# EasyEDA Pro project ProProject_STM32F407IGT6_2024-02-27.epro, board PCB2_1
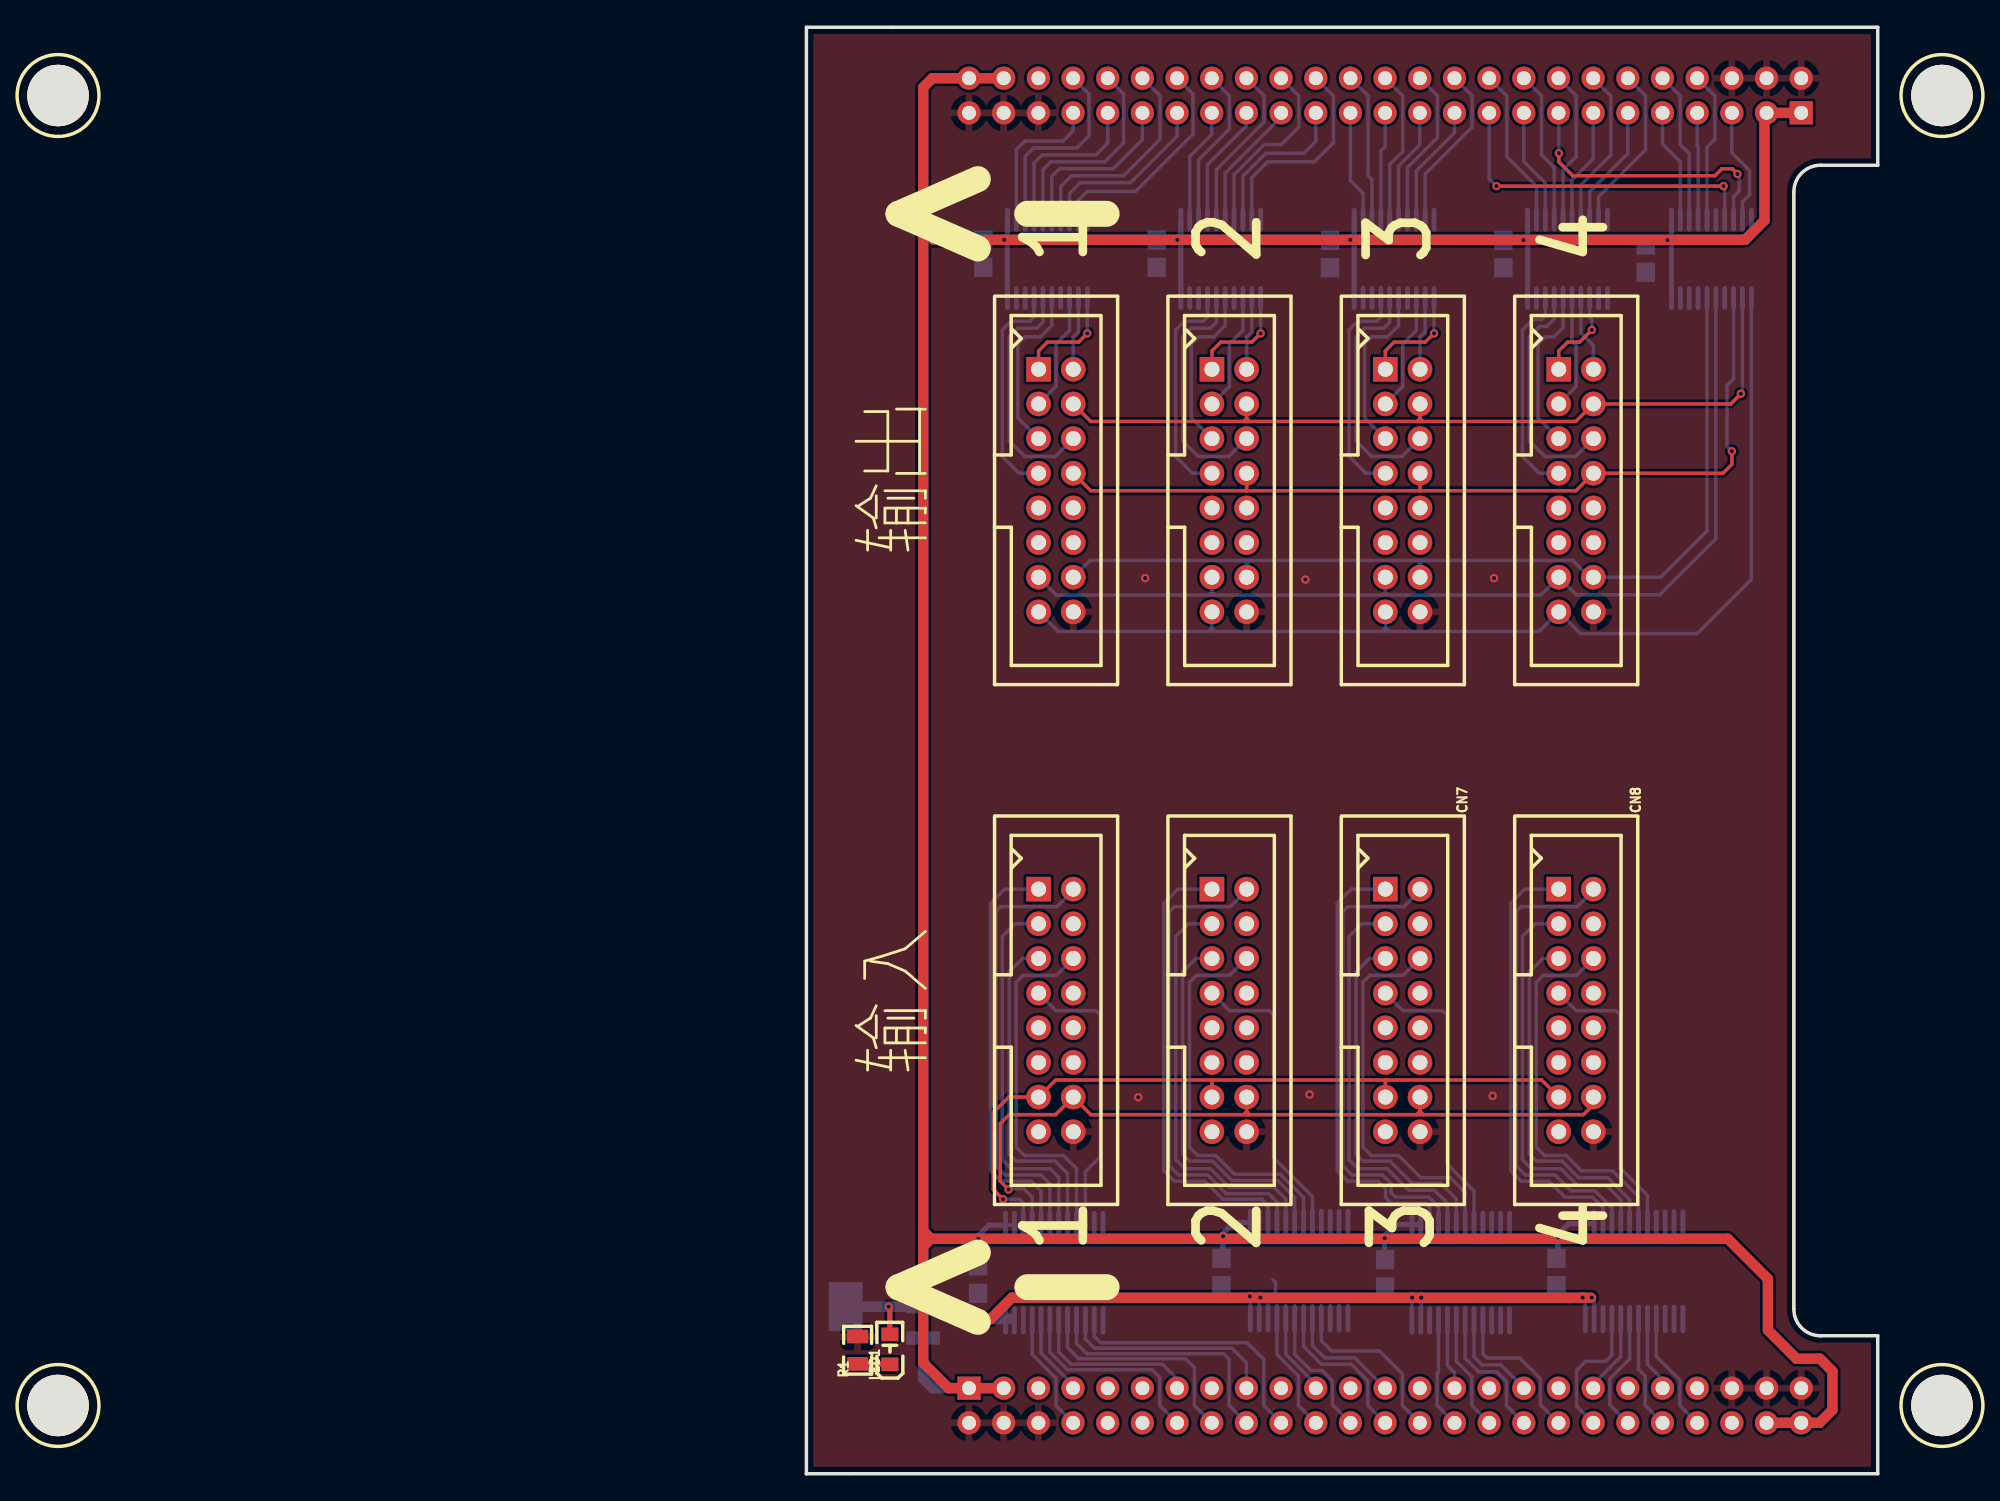
[diagram p4: board, top side]
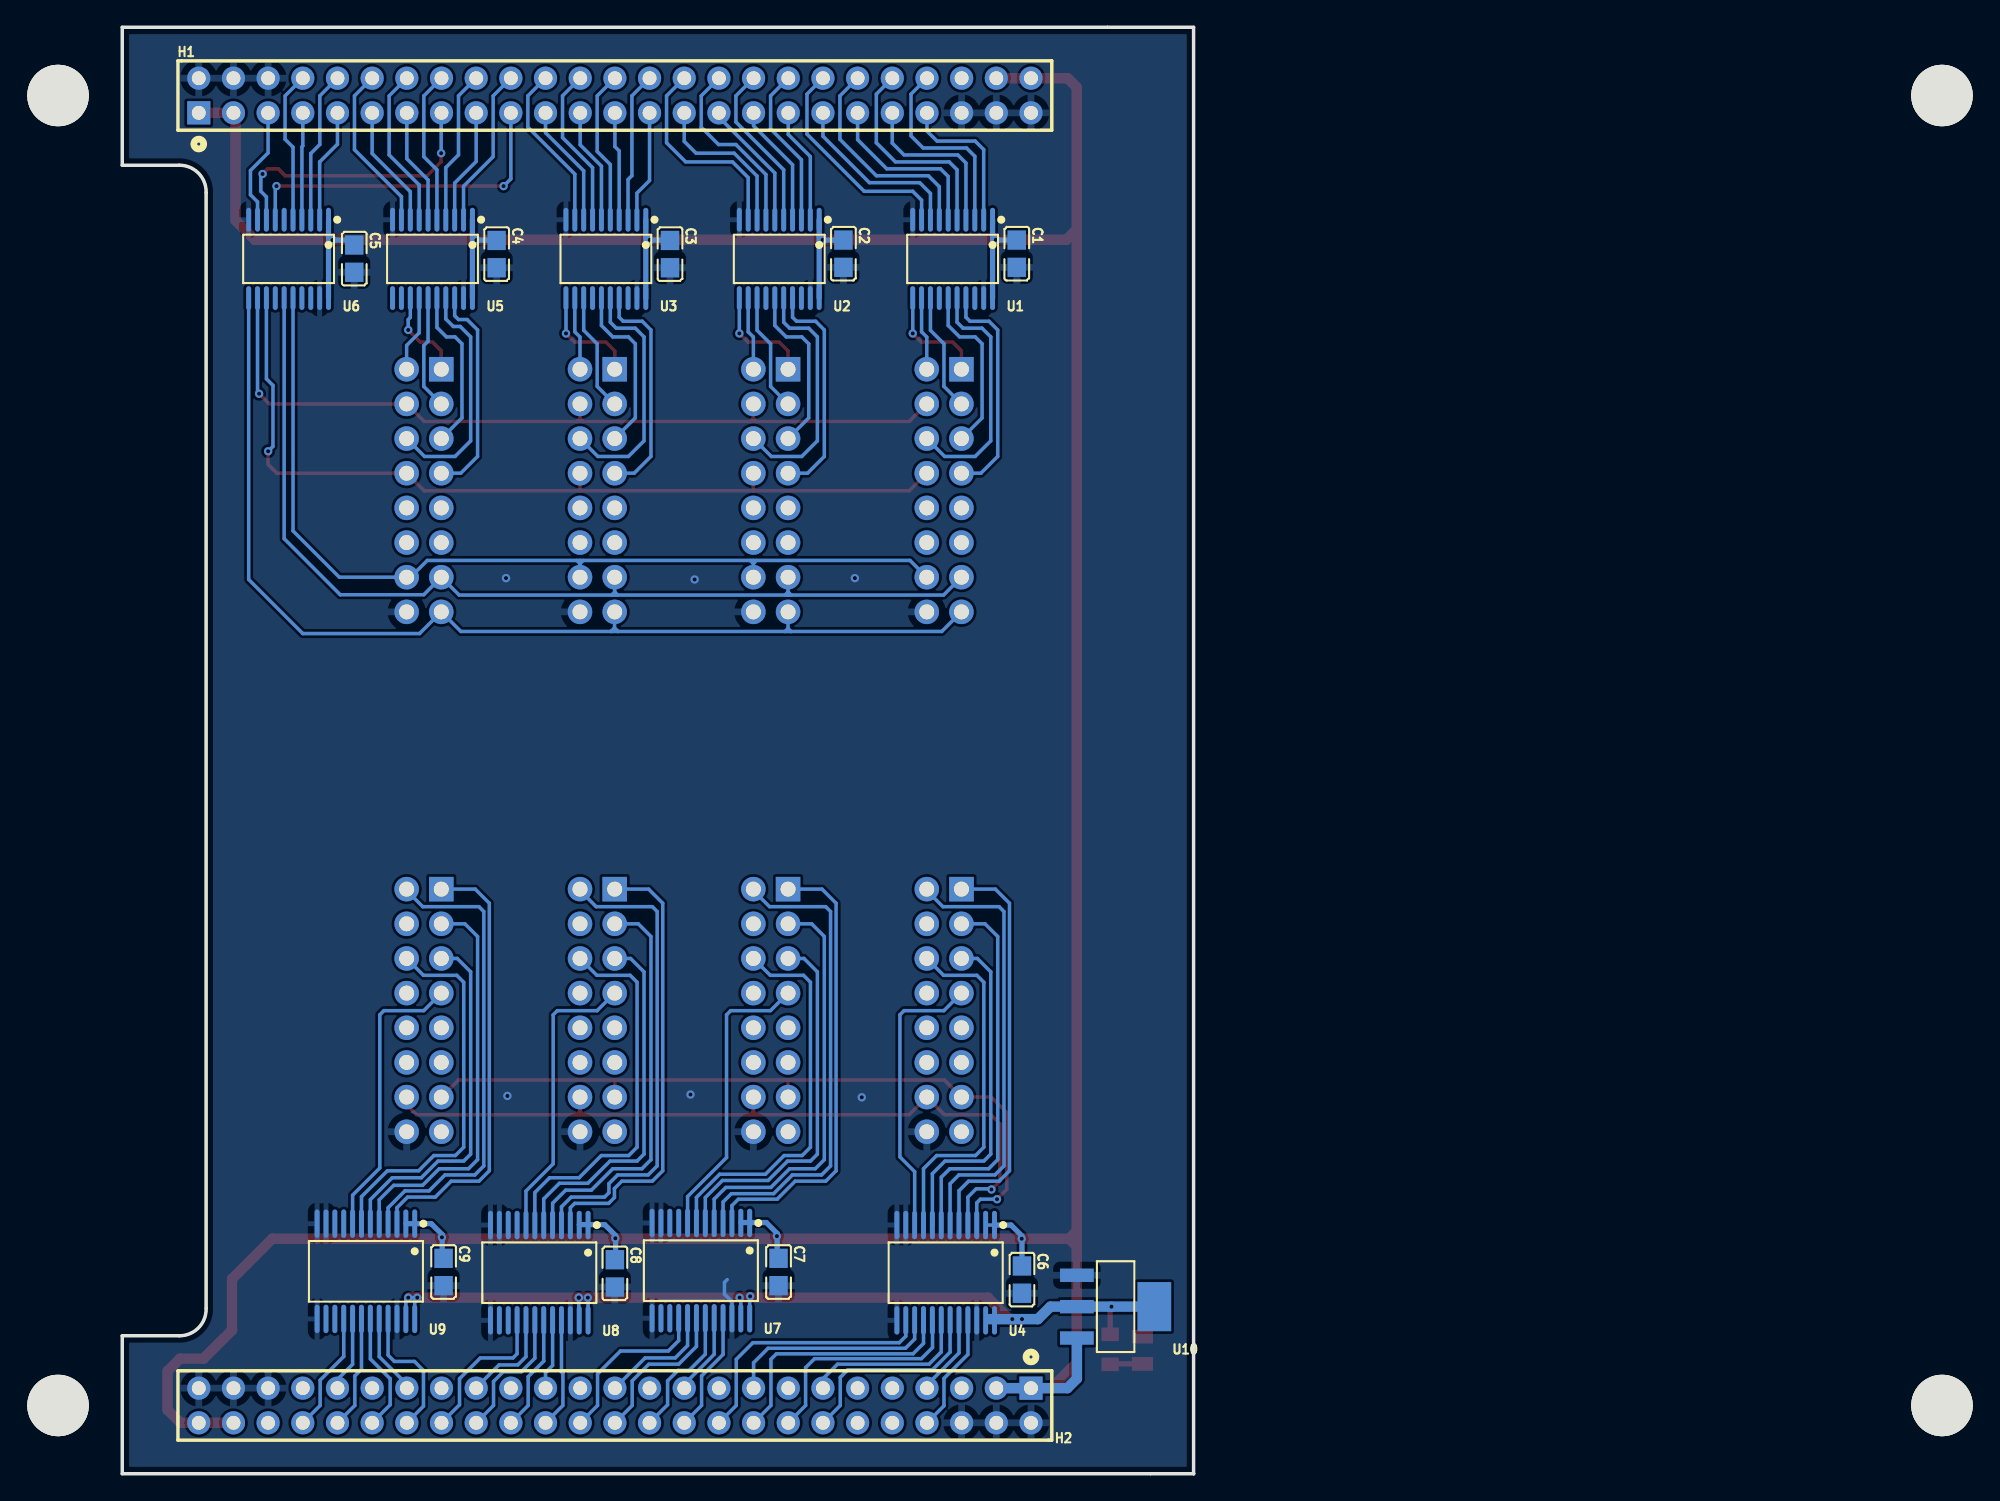
[diagram p5: board, bottom side, seen from below]

Outline 78.48 x 106 mm; copper layers: Top Layer, Bottom Layer. Coordinates in mm from the lower left corner of the outline.
Outline path: 0,0 78.48,0 78.48,10.11 74.29,10.11 arc(72.89,10.7) 72.33,12.11 72.33,93.89 arc(72.89,95.3) 74.29,95.89 78.48,95.89 78.48,106 0,106 0,0 0,0
Stack: Top Layer 0.035mm / Dielectric1 1.51mm FR4 er 4.5 / Bottom Layer 0.035mm

## Design rules (mm)
template: JLCPCB Capability(Two Layers Board)
spacing copperThickness1oz (default): track to track 0.102, other pairs 0.152 to 0.3
spacing copperThickness2oz: track to track 0.203, other pairs 0.152 to 0.3
track width copperThickness1oz (default): min 0.127, default 0.254, max 2.54
track width copperThickness2oz: min 0.203, default 0.254, max 2.54
differential pair differentialPair (default): width min 0.127, default 0.254, max 2.54; gap min 0.152, default 0.152
via viaSize (default): diameter min 0.5, default 0.61, max 10; hole min 0.3, default 0.305, max 6.3

## Placement (name value [footprint] x y rotation side)
C1  100nF  [C0805]  12.95 89.41 270 bottom
C2  100nF  [C0805]  25.65 89.41 270 bottom
C3  100nF  [C0805]  38.35 89.38 270 bottom
C4  100nF  [C0805]  51.05 89.38 270 bottom
C5  100nF  [C0805]  61.48 89.05 270 bottom
C6  100nF  [C0805]  12.57 14.22 270 bottom
C7  100nF  [C0805]  30.4 14.78 270 bottom
C8  100nF  [C0805]  42.39 14.68 270 bottom
C9  100nF  [C0805]  54.94 14.78 270 bottom
CN1  BH254V-16P  [IDC-TH_16P-P2.54-V-R2-C8-S2.54]  56.38 72.05 270 top
CN2  BH254V-16P  [IDC-TH_16P-P2.54-V-R2-C8-S2.54]  43.68 72.05 270 top
CN3  BH254V-16P  [IDC-TH_16P-P2.54-V-R2-C8-S2.54]  30.98 72.05 270 top
CN4  BH254V-16P  [IDC-TH_16P-P2.54-V-R2-C8-S2.54]  18.28 72.05 270 top
CN5  BH254V-16P  [IDC-TH_16P-P2.54-V-R2-C8-S2.54]  18.28 33.95 270 top
CN6  BH254V-16P  [IDC-TH_16P-P2.54-V-R2-C8-S2.54]  30.98 33.95 270 top
CN7  BH254V-16P  [IDC-TH_16P-P2.54-V-R2-C8-S2.54]  43.68 33.95 270 top
CN8  BH254V-16P  [IDC-TH_16P-P2.54-V-R2-C8-S2.54]  56.38 33.95 270 top
H1  FH-00077  [HDR-TH_50P-P2.54-V-F-R2-C25-S2.54-1]  42.39 101 180 bottom
H2  FH-00077  [HDR-TH_50P-P2.54-V-F-R2-C25-S2.54-1]  42.39 5 0 bottom
LED1  -  [LED0805-RD_RED]  6.12 9.11 90 top
NOREF  -  [Pad_ie198]  83.18 5 180 top
NOREF#2  -  [Pad_ie201]  -54.82 5 180 top
NOREF#3  -  [Pad_ie205]  -54.82 101 180 top
NOREF#4  -  [Pad_ie168]  83.18 101 180 top
R1  1K  [R0805]  3.75 9.05 90 top
U1  SN74HC245PW  [TSSOP-20_L6.5-W4.4-P0.65-LS6.4-BL]  17.65 89.03 0 bottom
U2  SN74HC245PW  [TSSOP-20_L6.5-W4.4-P0.65-LS6.4-BL]  30.35 89.03 0 bottom
U3  SN74HC245PW  [TSSOP-20_L6.5-W4.4-P0.65-LS6.4-BL]  43.05 89.03 0 bottom
U4  SN74LVC4245ADBR  [SSOP-24_L8.4-W5.8-P0.65-LS7.8-BL]  18.16 14.73 0 bottom
U5  SN74HC245PW  [TSSOP-20_L6.5-W4.4-P0.65-LS6.4-BL]  55.75 89.03 0 bottom
U6  SN74HC245PW  [TSSOP-20_L6.5-W4.4-P0.65-LS6.4-BL]  66.29 89.03 0 bottom
U7  SN74LVC4245ADBR  [SSOP-24_L8.4-W5.8-P0.65-LS7.8-BL]  36.09 14.88 0 bottom
U8  SN74LVC4245ADBR  [SSOP-24_L8.4-W5.8-P0.65-LS7.8-BL]  47.93 14.73 0 bottom
U9  SN74LVC4245ADBR  [SSOP-24_L8.4-W5.8-P0.65-LS7.8-BL]  60.63 14.83 0 bottom
U10  AMS1117-3.3  [SOT-223-4_L6.5-W3.5-P2.30-LS7.0-BR]  5.72 12.24 0 bottom

## Footprints (pads in the part's own frame, mm; a bottom-side part is the same pattern mirrored in y, then rotated)
C0805
  rect 1.41x1.35 smd: 1(-1,0) 2(1,0)
HDR-TH_50P-P2.54-V-F-R2-C25-S2.54-1
  rect 1.7x1.7 hole 1.02: 1(-30.48,-1.27)
  round 1.7 hole 1.02: 2(-30.48,1.27) 3(-27.94,-1.27) 4(-27.94,1.27) 5(-25.4,-1.27) 6(-25.4,1.27) 7(-22.86,-1.27) 8(-22.86,1.27) 9(-20.32,-1.27) 10(-20.32,1.27) 11(-17.78,-1.27) 12(-17.78,1.27) 13(-15.24,-1.27) 14(-15.24,1.27) 15(-12.7,-1.27) 16(-12.7,1.27) 17(-10.16,-1.27) 18(-10.16,1.27) 19(-7.62,-1.27) 20(-7.62,1.27) 21(-5.08,-1.27) 22(-5.08,1.27) 23(-2.54,-1.27) 24(-2.54,1.27) 25(0,-1.27) 26(0,1.27) 27(2.54,-1.27) 28(2.54,1.27) 29(5.08,-1.27) 30(5.08,1.27) 31(7.62,-1.27) 32(7.62,1.27) 33(10.16,-1.27) 34(10.16,1.27) 35(12.7,-1.27) 36(12.7,1.27) 37(15.24,-1.27) 38(15.24,1.27) 39(17.78,-1.27) 40(17.78,1.27) 41(20.32,-1.27) 42(20.32,1.27) 43(22.86,-1.27) 44(22.86,1.27) 45(25.4,-1.27) 46(25.4,1.27) 47(27.94,-1.27) 48(27.94,1.27) 49(30.48,-1.27) 50(30.48,1.27)
IDC-TH_16P-P2.54-V-R2-C8-S2.54
  rect 1.8x1.8 hole 1.1: 1(-8.89,-1.27)
  round 1.8 hole 1.1: 2(-8.89,1.27) 3(-6.35,-1.27) 4(-6.35,1.27) 5(-3.81,-1.27) 6(-3.81,1.27) 7(-1.27,-1.27) 8(-1.27,1.27) 9(1.27,-1.27) 10(1.27,1.27) 11(3.81,-1.27) 12(3.81,1.27) 13(6.35,-1.27) 14(6.35,1.27) 15(8.89,-1.27) 16(8.89,1.27)
LED0805-RD_RED
  rect 1x1.25 smd: 1(-1.1,0) 2(1.1,0)
Pad_ie168
  round 4.5 hole 4.5: 4(0,0)
Pad_ie198
  round 4.5 hole 4.5: 4(0,0)
Pad_ie201
  round 4.5 hole 4.5: 4(0,0)
Pad_ie205
  round 4.5 hole 4.5: 4(0,0)
R0805
  rect 1x1.55 smd: 1(-1,0) 2(1,0)
SOT-223-4_L6.5-W3.5-P2.30-LS7.0-BR
  rect 2.47x0.98 smd: 1(2.835,-2.3) 2(2.835,0) 3(2.835,2.3)
  rect 2.47x3.6 smd: 4(-2.835,0)
SSOP-24_L8.4-W5.8-P0.65-LS7.8-BL
  oval 0.364x2.082 smd: 1(-3.575,-3.491) 2(-2.925,-3.491) 3(-2.275,-3.491) 4(-1.625,-3.491) 5(-0.975,-3.491) 6(-0.325,-3.491) 7(0.325,-3.491) 8(0.975,-3.491) 9(1.625,-3.491) 10(2.275,-3.491) 11(2.925,-3.491) 12(3.575,-3.491) 13(3.575,3.491) 14(2.925,3.491) 15(2.275,3.491) 16(1.625,3.491) 17(0.975,3.491) 18(0.325,3.491) 19(-0.325,3.491) 20(-0.975,3.491) 21(-1.625,3.491) 22(-2.275,3.491) 23(-2.925,3.491) 24(-3.575,3.491)
TSSOP-20_L6.5-W4.4-P0.65-LS6.4-BL
  oval 0.364x1.742 smd: 1(-2.925,-2.871) 2(-2.275,-2.871) 3(-1.625,-2.871) 4(-0.975,-2.871) 5(-0.325,-2.871) 6(0.325,-2.871) 7(0.975,-2.871) 8(1.625,-2.871) 9(2.275,-2.871) 10(2.925,-2.871) 11(2.925,2.871) 12(2.275,2.871) 13(1.625,2.871) 14(0.975,2.871) 15(0.325,2.871) 16(-0.325,2.871) 17(-0.975,2.871) 18(-1.625,2.871) 19(-2.275,2.871) 20(-2.925,2.871)

## Nets
+3.3V: LED1.2 U4.23 U4.24 U7.23 U7.24 U8.23 U8.24 U9.23 U9.24 U10.2 U10.4
+5V: C1.1 C2.1 C3.1 C4.1 C5.1 C6.1 C7.1 C8.1 C9.1 H1.1 H1.3 H1.48 H1.50 H2.1 H2.3 H2.48 H2.50 U1.1 U1.20 U2.1 U2.20 U3.1 U3.20 U4.1 U4.2 U5.1 U5.20 U6.1 U6.20 U7.1 U7.2 U8.1 U8.2 U9.1 U9.2 U10.3
GND: C1.2 C2.2 C3.2 C4.2 C5.2 C6.2 C7.2 C8.2 C9.2 CN1.16 CN2.16 CN3.16 CN4.16 CN5.16 CN6.16 CN7.16 CN8.16 H1.2 H1.4 H1.6 H1.45 H1.47 H1.49 H2.2 H2.4 H2.6 H2.45 H2.47 H2.49 R1.2 U1.10 U1.19 U2.10 U2.19 U3.10 U3.19 U4.11 U4.12 U4.13 U4.22 U5.10 U5.19 U6.10 U6.19 U7.11 U7.12 U7.13 U7.22 U8.11 U8.12 U8.13 U8.22 U9.11 U9.12 U9.13 U9.22 U10.1
BD0: H1.16 U5.5
BD1: H1.20 U5.2
BD2: H1.24 U3.7
BD3: H1.28 U3.3
BD4: H1.32 U2.7
BD5: H1.36 U2.3
BD6: H1.40 U1.7
BD7: H1.44 U1.3
BD8: H2.16 U4.17
BD9: H2.20 U4.14
BD10: H2.24 U7.19
BD11: H2.28 U7.16
BD12: H2.32 U8.19
BD13: H2.36 U8.16
BD14: H2.40 U9.19
BD15: H2.44 U9.16
CKA: H1.8 U6.5
CKA_IN: H2.8 U4.21
CLK: CN1.13 CN2.13 CN3.13 CN4.13 CN5.13 CN6.13 CN7.13 CN8.13 U4.3 U6.15
CN1_NC2: H1.23 U3.6
CN1_NC2_O: U3.14
CN1_NC3: H1.27 U3.2
CN1_NC3_O: U3.18
CN1_NC4: H1.31 U2.6
CN1_NC4_O: U2.14
CN1_NC5: H1.35 U2.2
CN1_NC5_O: U2.18
CN1_NC6: H1.39 U1.6
CN1_NC6_O: U1.14
CN1_NC7: H1.43 U1.2
CN1_NC7_O: U1.18
CN1_NC8: H1.46
CN2_NC0: H2.15
CN2_NC1: H2.19
CN2_NC2: H2.23
CN2_NC3: H2.27
CN2_NC4: H2.31
CN2_NC5: H2.35
CN2_NC6: H2.39
CN2_NC7: H2.43
CN2_NC8: H2.46
GD0: H1.13 U5.6
GD1: H1.17 U5.3
GD2: H1.21 U3.8
GD3: H1.25 U3.4
GD4: H1.29 U2.8
GD5: H1.33 U2.4
GD6: H1.37 U1.8
GD7: H1.41 U1.4
GD8: H2.13 U4.18
GD9: H2.17 U4.15
GD10: H2.21 U7.20
GD11: H2.25 U7.17
GD12: H2.29 U8.20
GD13: H2.33 U8.17
GD14: H2.37 U9.20
GD15: H2.41 U9.17
HUB1_B1: CN1.3 U5.15
HUB1_B2: CN1.7 U5.18
HUB1_G1: CN1.2 U5.14
HUB1_G2: CN1.6 U5.17
HUB1_R1: CN1.1 U5.13
HUB1_R2: CN1.5 U5.16
HUB2_B1: CN2.3 U3.13
HUB2_B2: CN2.7 U3.17
HUB2_G1: CN2.2 U3.12
HUB2_G2: CN2.6 U3.16
HUB2_R1: CN2.1 U3.11
HUB2_R2: CN2.5 U3.15
HUB3_B1: CN3.3 U2.13
HUB3_B2: CN3.7 U2.17
HUB3_G1: CN3.2 U2.12
HUB3_G2: CN3.6 U2.16
HUB3_R1: CN3.1 U2.11
HUB3_R2: CN3.5 U2.15
HUB4_B1: CN4.3 U1.13
HUB4_B2: CN4.7 U1.17
HUB4_G1: CN4.2 U1.12
HUB4_G2: CN4.6 U1.16
HUB4_R1: CN4.1 U1.11
HUB4_R2: CN4.5 U1.15
HUB5_B1: CN5.3 U4.7
HUB5_B2: CN5.7 U4.10
HUB5_G1: CN5.2 U4.6
HUB5_G2: CN5.6 U4.9
HUB5_R1: CN5.1 U4.5
HUB5_R2: CN5.5 U4.8
HUB6_B1: CN6.3 U7.5
HUB6_B2: CN6.7 U7.8
HUB6_G1: CN6.2 U7.4
HUB6_G2: CN6.6 U7.7
HUB6_R1: CN6.1 U7.3
HUB6_R2: CN6.5 U7.6
HUB7_B1: CN7.3 U8.5
HUB7_B2: CN7.7 U8.8
HUB7_G1: CN7.2 U8.4
HUB7_G2: CN7.6 U8.7
HUB7_R1: CN7.1 U8.3
HUB7_R2: CN7.5 U8.6
HUB8_B1: CN8.3 U9.5
HUB8_B2: CN8.7 U9.8
HUB8_G1: CN8.2 U9.4
HUB8_G2: CN8.6 U9.7
HUB8_R1: CN8.1 U9.3
HUB8_R2: CN8.5 U9.6
LAT: CN1.14 CN2.14 CN3.14 CN4.14 CN5.14 CN6.14 CN7.14 CN8.14 U4.4 U6.16
OE_PWM_B: H1.19 U6.7
OE_PWM_B_O: CN1.8 CN2.8 CN3.8 CN4.8 U6.13
OE_PWM_G: H1.15 U6.8
OE_PWM_G_O: CN1.4 CN2.4 CN3.4 CN4.4 U6.12
OE_PWM_R: H1.5 U6.9
OE_PWM_R_O: CN1.15 CN2.15 CN3.15 CN4.15 U6.11
RD0: H1.14 U5.7
RD1: H1.18 U5.4
RD2: H1.22 U3.9
RD3: H1.26 U3.5
RD4: H1.30 U2.9
RD5: H1.34 U2.5
RD6: H1.38 U1.9
RD7: H1.42 U1.5
RD8: H2.14 U4.19
RD9: H2.18 U4.16
RD10: H2.22 U7.21
RD11: H2.26 U7.18
RD12: H2.30 U8.21
RD13: H2.34 U8.18
RD14: H2.38 U9.21
RD15: H2.42 U9.18
STB: H1.7 U6.4
STB_IN: H2.7 U4.20
$1N2786: H2.5
$1N5133: U6.6
$1N5154: U6.14
$1N5922: CN5.15
$1N5952: CN6.15
$1N5982: CN7.15
$1N6012: CN8.15
$1N6595: U7.9
$1N6597: U7.10
$1N6609: U7.15
$1N6611: U7.14
$1N6833: U8.9
$1N6835: U8.10
$1N6847: U8.15
$1N6849: U8.14
$1N7071: U9.9
$1N7073: U9.10
$1N7180: U9.15
$1N7181: U9.14
$1N9953: LED1.1 R1.1

Pads without a net: CN1 9 10 11 12; CN2 9 10 11 12; CN3 9 10 11 12; CN4 9 10 11 12; CN5 4 8 9 10 11 12; CN6 4 8 9 10 11 12; CN7 4 8 9 10 11 12; CN8 4 8 9 10 11 12; H1 9 10 11 12; H2 9 10 11 12; NOREF 4; NOREF#2 4; NOREF#3 4; NOREF#4 4; U5 8 9 11 12; U6 2 3 17 18

## Via types
v1: diameter 0.61, hole 0.305, Top Layer to Bottom Layer, 37 vias

## Routing (per net, layer and track width the routed paths; a pad name or vN(x,y) marks a point on that pad's centre or on a via; arc(x,y) is an arc through that point)
+3.3V: length 70.7
  Top Layer w0.254: v1(32.49,13) 32.48,13 32.48,12.9 ; v1(13.28,11.33) 13.28,11.38
  Top Layer w0.381: LED1.2 6.12,12.15 v1(6.02,12.24)
  Top Layer w0.762: v1(12.57,11.33) v1(13.28,11.33) 13.49,11.33 15.06,12.9 v1(33.26,12.9) v1(44.37,12.9) v1(45.04,12.9) v1(56.87,12.9) 57.48,12.9
  Bottom Layer w0.254: U7.24 32.52,12.97 v1(32.49,13) ; v1(33.26,12.9) 33.17,12.82 U7.23 ; U8.24 44.36,12.88 v1(44.37,12.9) ; v1(45.04,12.9) 45.04,11.27 U8.23 ; U9.23 57.7,12.73 v1(57.53,12.9) v1(56.87,12.9) 57.06,12.72 U9.24
  Bottom Layer w0.762: U10.4 v1(6.02,12.24) 10.49,12.24 11.4,11.33 v1(12.57,11.33) v1(13.28,11.33) 14.96,11.33
+5V: length 329.6
  Top Layer w0.762: H2.3 H2.1 10.42,6.27 8.56,8.13 8.56,16.66 ; 9.13,17.22 8.56,17.79 ; 9.13,17.22 8.56,16.66 ; 9.13,17.22 v1(12.59,17.22) 67.49,17.22 70.43,14.28 70.43,10.52 72.52,8.43 74.24,8.43 75.16,7.52 75.16,4.67 74.22,3.73 H2.50 H2.48 ; 8.56,17.79 8.56,16.66 ; 8.56,17.79 8.56,91.19 ; 8.56,91.19 9.32,90.42 v1(14.49,90.42) v1(27.17,90.42) v1(39.84,90.42) 68.76,90.42 70.18,91.85 70.18,99.47 ; 8.56,91.19 8.56,101.6 9.23,102.27 H1.50 H1.48 ; H1.1 70.44,99.73 70.18,99.47 ; 70.18,99.47 70.18,99.58 H1.3
  Bottom Layer w0.254: 14.59,18.22 U4.2
  Bottom Layer w0.381: C1.1 14.44,90.41 14.73,90.7 ; 33.17,18.41 31.3,18.41 30.51,17.61 30.51,15.41 ; 52.83,90.7 v1(52.54,90.41) 51.05,90.41 ; 52.83,90.7 U5.1 ; 52.83,90.7 U5.20 ; 27.43,90.7 U2.1 ; 27.43,90.7 27.14,90.41 C2.1 ; 27.43,90.7 U2.20 ; 40.13,90.7 39.84,90.41 38.35,90.41 ; 40.13,90.7 U3.1 ; 40.13,90.7 U3.20 ; 63.37,90.7 v1(63.08,90.41) 61.6,90.41 ; 63.37,90.7 U6.1 ; 63.37,90.7 U6.20 ; 14.73,90.7 U1.20 ; 14.73,90.7 U1.1 ; 42.34,15.26 42.34,17.46 43.14,18.26 45.01,18.26 ; U9.2 U9.1 55.84,18.32 55.04,17.53 55.04,15.33 ; C6.1 12.57,17.42 13.37,18.22 14.59,18.22
  Bottom Layer w0.762: 8.55,9.94 8.55,6.97 9.25,6.27 H2.1 H2.3
  vias: v1(30.53,17.41) v1(42.36,17.25) v1(55.06,17.32)
GND: length 3.1
  Bottom Layer w0.254: 34.16,14.22 34.37,14.02 34.37,13.16 33.82,12.61 U7.22
  vias: v1(24.31,27.58) v1(24.82,65.63) v1(36.55,65.53) v1(36.86,27.79) v1(50.27,27.69) v1(50.37,65.63)
(no net): length 40.9
  Bottom Layer w0.254: H1.12 61.47,100.97 61.47,97.03 58.03,93.59 U5.9 ; U6.2 64.02,96.13 ; 64.02,96.13 62.71,97.43 H1.9 ; 64.02,96.13 64.02,96.14 ; H1.11 60.17,96.75 57.38,93.95 U5.8 ; U6.3 64.67,96.75 64.01,97.41 64.01,100.97 H1.10
BD0: length 11.3
  Bottom Layer w0.254: U5.5 55.43,95.56 56.39,96.52 56.39,100.97 H1.16
BD1: length 11.8
  Bottom Layer w0.254: U5.2 53.48,94.35 51.31,96.52 51.31,100.97 H1.20
BD2: length 11.8
  Bottom Layer w0.254: H1.24 46.23,100.97 46.23,97.92 44.03,95.72 U3.7
BD3: length 11
  Bottom Layer w0.254: H1.28 41.15,100.97 41.15,95.12 41.43,94.84 U3.3
BD4: length 13.6
  Bottom Layer w0.254: H1.32 36.07,100.97 36.07,98.68 34.8,97.41 33.53,97.41 31.33,95.21 U2.7
BD5: length 11.8
  Bottom Layer w0.254: U2.3 28.73,96.29 30.99,98.55 30.99,100.97 H1.36
BD6: length 16.2
  Bottom Layer w0.254: U1.7 18.63,94.32 19.43,95.12 23.24,95.12 25.91,97.79 25.91,100.97 H1.40
BD7: length 14.7
  Bottom Layer w0.254: H1.44 20.7,101.1 20.7,98.04 19.81,97.16 16.64,97.16 16.03,96.55 U1.3
BD8: length 16.5
  Bottom Layer w0.254: H2.16 28.42,5 28.42,7.77 27.76,8.43 19.94,8.43 19.13,9.25 19.13,11.23 U4.17
BD9: length 19.5
  Bottom Layer w0.254: H2.20 33.5,5 33.5,8.38 32.28,9.6 21.56,9.6 21.09,10.07 U4.14
BD10: length 9.8
  Bottom Layer w0.254: U7.19 35.77,8.76 36.96,7.57 37.77,7.57 38.53,6.81 38.53,5.05 H2.24
BD11: length 12.7
  Bottom Layer w0.254: U7.16 37.72,9.75 38.48,8.99 41.99,8.99 43.66,7.31 43.66,5 H2.28
BD12: length 8.5
  Bottom Layer w0.254: H2.32 48.74,5 48.74,7.11 47.61,8.25 U8.19
BD13: length 11.2
  Bottom Layer w0.254: H2.36 53.77,5.05 53.77,6.96 52.25,8.48 49.86,8.48 49.56,8.79 U8.16
BD14: length 8.8
  Bottom Layer w0.254: U9.19 60.31,8.41 58.85,6.96 58.85,5.05 H2.40
BD15: length 8.9
  Bottom Layer w0.254: U9.16 62.26,8.59 63.98,6.86 63.98,5 H2.44
CKA: length 11.1
  Bottom Layer w0.254: U6.5 65.97,97.21 66.55,97.79 66.55,100.97 H1.8
CKA_IN: length 8.8
  Bottom Layer w0.254: H2.8 18.29,4.97 18.29,6.99 16.54,8.74 U4.21
CLK: length 129.8
  Top Layer w0.254: v1(14.4,20.12) 13.69,20.83 13.69,26.47 14.82,27.6 CN5.13 18.26,28.85 29.65,28.85 ; CN6.13 29.71,28.8 29.65,28.85 ; CN8.13 53.85,28.85 42.43,28.85 ; 42.43,28.85 29.65,28.85 ; 42.43,28.85 42.41,28.83 CN7.13
  Bottom Layer w0.254: 29.71,64.39 29.93,64.39 ; 29.71,64.39 29.71,64.39 29.71,64.61 ; 29.71,64.39 29.48,64.39 ; 29.93,64.39 29.71,64.61 ; 29.93,64.39 42.18,64.39 ; 42.41,64.61 42.18,64.39 ; 42.41,64.61 CN2.13 ; 42.41,64.61 42.63,64.39 ; 42.41,64.61 42.41,64.39 42.41,64.39 ; 42.18,64.39 42.41,64.39 ; 29.71,64.61 29.48,64.39 ; 29.71,64.61 CN3.13 ; 29.48,64.39 18.32,64.39 CN4.13 ; 42.63,64.39 53.8,64.39 CN1.13 56.39,64.41 62.51,64.41 66.62,68.52 U6.15 ; 42.63,64.39 42.41,64.39 ; 15.89,18.22 15.89,19.85 15.62,20.12 v1(14.4,20.12)
CN1_NC2: length 8.5
  Bottom Layer w0.254: H1.23 44.93,97.38 43.38,95.83 U3.6
CN1_NC3: length 8.2
  Bottom Layer w0.254: U3.2 40.78,93.84 39.85,94.77 H1.27
CN1_NC4: length 9.5
  Bottom Layer w0.254: H1.31 34.77,99.42 30.68,95.32 30.68,91.9
CN1_NC5: length 8.5
  Bottom Layer w0.254: H1.35 29.69,98.15 28.08,96.53 28.08,91.9
CN1_NC6: length 12.9
  Bottom Layer w0.254: U1.6 17.98,95.07 18.54,95.63 22.48,95.63 24.61,97.77 H1.39
CN1_NC7: length 11.2
  Bottom Layer w0.254: H1.43 19.53,98.4 18.8,97.66 16,97.66 15.38,97.04 U1.2
GD0: length 8.5
  Bottom Layer w0.254: H1.13 57.63,96.37 56.08,94.81 56.08,91.9
GD1: length 8.5
  Bottom Layer w0.254: H1.17 52.55,96.16 54.13,94.59 U5.3
GD2: length 9
  Bottom Layer w0.254: U3.8 44.68,95.48 47.47,98.27 H1.21
GD3: length 8
  Bottom Layer w0.254: H1.25 42.39,97.26 42.08,96.94 U3.4
GD4: length 11.7
  Bottom Layer w0.254: U2.8 31.98,95.1 33.66,96.77 36.45,96.77 37.31,97.64 H1.29
GD5: length 9
  Bottom Layer w0.254: H1.33 32.23,98.78 29.38,95.93 U2.4
GD6: length 13.3
  Bottom Layer w0.254: U1.8 19.28,93.83 20.07,94.61 23.75,94.61 27.15,98.02 H1.37
GD7: length 12.4
  Bottom Layer w0.254: U1.4 16.68,96.05 17.27,96.65 21.21,96.65 22.07,97.51 H1.41
GD8: length 12.5
  Bottom Layer w0.254: H2.13 27.15,6.96 26.09,8.03 19.38,8.03 18.49,8.92 U4.18
GD9: length 15.7
  Bottom Layer w0.254: H2.17 32.23,8.13 31.17,9.19 21.11,9.19 20.44,9.87 U4.15
GD10: length 6
  Bottom Layer w0.254: H2.21 37.31,6.55 35.12,8.75 U7.20
GD11: length 8.6
  Bottom Layer w0.254: U7.17 37.07,9.39 37.97,8.48 40.18,8.48 H2.25
GD12: length 5.2
  Bottom Layer w0.254: H2.29 47.47,7.42 46.95,7.93 U8.20
GD13: length 7.3
  Bottom Layer w0.254: H2.33 52.55,6.3 50.88,7.98 49.5,7.98 48.91,8.58 U8.17
GD14: length 5.9
  Bottom Layer w0.254: H2.37 57.63,6.55 59.65,8.58 U9.20
GD15: length 5.5
  Bottom Layer w0.254: U9.17 61.61,8.02 62.71,6.91 H2.41
HUB1_B1: length 8.4
  Bottom Layer w0.254: 56.08,86.16 56.08,82.99 56.39,82.68 56.39,79.68 CN1.3
HUB1_B2: length 15.8
  Bottom Layer w0.254: U5.18 54.13,84.86 53.85,84.58 53.21,84.58 52.45,83.82 52.45,74.55 53.68,73.32 CN1.7
HUB1_G1: length 5.6
  Bottom Layer w0.254: U5.14 56.73,83.61 57.65,82.69 CN1.2
HUB1_G2: length 17.2
  Bottom Layer w0.254: U5.17 54.78,84.62 54.23,84.07 53.72,84.07 52.96,83.31 52.96,75.69 54.1,74.55 56.34,74.55 CN1.6
HUB1_R1: length 6.8
  Top Layer w0.254: v1(57.53,83.82) 56.64,82.93 55.75,82.93 55.11,82.29 CN1.1
  Bottom Layer w0.254: U5.13 57.38,84.73 57.53,84.58 v1(57.53,83.82)
HUB1_R2: length 12.1
  Bottom Layer w0.254: U5.16 55.43,84 54.74,83.31 54.1,83.31 53.59,82.8 53.59,77.37 CN1.5
HUB2_B1: length 8.7
  Bottom Layer w0.254: CN2.3 43.69,79.68 43.69,82.8 44.68,83.79 U3.13
HUB2_B2: length 16.6
  Bottom Layer w0.254: U3.17 42.08,84.75 41.78,84.45 40.39,84.45 39.75,83.82 39.75,74.55 40.98,73.32 CN2.7
HUB2_G1: length 5.4
  Bottom Layer w0.254: 44.95,80.94 44.95,83.3 45.33,83.68 U3.12
HUB2_G2: length 18
  Bottom Layer w0.254: 42.73,86.16 42.73,84.38 42.29,83.95 40.89,83.95 40.26,83.31 40.26,75.69 41.4,74.55 43.64,74.55 44.95,75.86
HUB2_R1: length 8
  Top Layer w0.254: v1(45.97,83.57) 45.34,82.93 43.05,82.93 42.41,82.29 CN2.1
  Bottom Layer w0.254: v1(45.97,83.57) 45.97,86.15 U3.11
HUB2_R2: length 12.6
  Bottom Layer w0.254: CN2.5 40.89,77.37 40.89,82.8 41.4,83.31 42.55,83.31 43.38,84.14 U3.15
HUB3_B1: length 8.7
  Bottom Layer w0.254: CN3.3 30.99,79.68 30.99,82.8 31.98,83.79 U2.13
HUB3_B2: length 16.6
  Bottom Layer w0.254: CN3.7 28.28,73.32 27.05,74.55 27.05,83.82 27.69,84.45 29.08,84.45 29.38,84.75 U2.17
HUB3_G1: length 5.4
  Bottom Layer w0.254: CN3.2 32.25,83.3 32.63,83.68 U2.12
HUB3_G2: length 18
  Bottom Layer w0.254: U2.16 30.03,84.38 29.59,83.95 28.19,83.95 27.56,83.31 27.56,75.69 28.7,74.55 30.94,74.55 CN3.6
HUB3_R1: length 8
  Top Layer w0.254: v1(33.27,83.57) 32.64,82.93 30.35,82.93 29.71,82.29 CN3.1
  Bottom Layer w0.254: v1(33.27,83.57) 33.27,86.15 U2.11
HUB3_R2: length 12.6
  Bottom Layer w0.254: 30.68,86.16 30.68,84.14 29.85,83.31 28.7,83.31 28.19,82.8 28.19,77.37 CN3.5
HUB4_B1: length 8.7
  Bottom Layer w0.254: CN4.3 18.29,79.68 18.29,82.8 19.28,83.79 U1.13
HUB4_B2: length 16.6
  Bottom Layer w0.254: U1.17 16.68,84.75 16.38,84.45 14.99,84.45 14.35,83.82 14.35,74.55 15.58,73.32 CN4.7
HUB4_G1: length 5.4
  Bottom Layer w0.254: CN4.2 19.55,83.3 19.93,83.68 U1.12
HUB4_G2: length 18
  Bottom Layer w0.254: U1.16 17.33,84.38 16.89,83.95 15.49,83.95 14.86,83.31 14.86,75.69 16,74.55 18.24,74.55 CN4.6
HUB4_R1: length 8
  Top Layer w0.254: CN4.1 17.01,82.29 17.65,82.93 19.94,82.93 v1(20.57,83.57)
  Bottom Layer w0.254: v1(20.57,83.57) 20.57,86.15 U1.11
HUB4_R2: length 12.6
  Bottom Layer w0.254: U1.15 17.98,84.14 17.15,83.31 16,83.31 15.49,82.8 15.49,77.37 CN4.5
HUB5_B1: length 27.6
  Bottom Layer w0.254: CN5.3 15.28,40.3 14.35,39.37 14.35,23.01 15.01,22.35 17.86,22.35 18.49,21.72 U4.7
HUB5_B2: length 21
  Bottom Layer w0.254: U4.10 20.44,22.14 21.51,23.22 21.51,33.63 21.21,33.93 18.29,33.93 CN5.7
HUB5_G1: length 32.5
  Bottom Layer w0.254: CN5.2 19.55,42.74 18.36,41.55 14.25,41.55 13.89,41.2 13.89,22.56 14.55,21.9 17.2,21.9 17.84,21.25 U4.6
HUB5_G2: length 26.2
  Bottom Layer w0.254: CN5.6 18.31,36.53 15.88,36.53 15.37,36.02 15.37,23.93 15.98,23.32 18.82,23.32 19.79,22.35 U4.9
HUB5_R1: length 30.4
  Bottom Layer w0.254: U4.5 17.19,20.74 16.48,21.44 14.25,21.44 13.49,22.2 13.49,41.81 14.52,42.84 CN5.1
HUB5_R2: length 24.5
  Bottom Layer w0.254: CN5.5 15.84,37.76 14.86,36.78 14.86,23.42 15.37,22.91 18.21,22.91 19.14,21.99 U4.8
HUB6_B1: length 30.4
  Bottom Layer w0.254: CN6.3 27.98,40.3 27.05,39.37 27.05,23.01 27.71,22.35 29.59,22.35 30.96,20.98 34.26,20.98 35.12,20.13 U7.5
HUB6_B2: length 21.6
  Bottom Layer w0.254: U7.8 37.07,20.31 34.21,23.16 34.21,33.63 33.91,33.93 30.99,33.93 CN6.7
HUB6_G1: length 35.5
  Bottom Layer w0.254: CN6.2 32.25,42.74 31.06,41.55 26.95,41.55 26.59,41.2 26.59,22.56 27.25,21.9 29.39,21.9 30.76,20.52 33.86,20.52 34.47,19.91 U7.4
HUB6_G2: length 28.7
  Bottom Layer w0.254: CN6.6 31.01,36.53 28.58,36.53 28.07,36.02 28.07,23.93 28.68,23.32 30,23.32 31.37,21.95 34.72,21.95 36.42,20.25 U7.7
HUB6_R1: length 33.5
  Bottom Layer w0.254: CN6.1 27.22,42.84 26.19,41.81 26.19,22.2 26.95,21.44 29.18,21.44 30.51,20.12 33.35,20.12 33.82,19.65 U7.3
HUB6_R2: length 27.3
  Bottom Layer w0.254: U7.6 35.77,20.24 34.52,21.49 31.17,21.49 29.74,22.91 28.07,22.91 27.56,23.42 27.56,36.78 28.54,37.76 CN6.5
HUB7_B1: length 29.5
  Bottom Layer w0.254: U8.5 46.95,19.82 46,20.78 44.12,20.78 42.55,22.35 40.41,22.35 39.75,23.01 39.75,39.37 40.68,40.3 CN7.3
HUB7_B2: length 21.4
  Bottom Layer w0.254: U8.8 48.91,20.72 46.91,22.71 46.91,33.63 46.61,33.93 43.69,33.93 CN7.7
HUB7_G1: length 35
  Bottom Layer w0.254: CN7.2 44.95,42.74 43.76,41.55 39.65,41.55 39.29,41.2 39.29,22.56 39.95,21.9 42.19,21.9 42.83,21.25 42.83,20.59 43.15,20.27 45.59,20.27 46.3,19.56 U8.4
HUB7_G2: length 28.2
  Bottom Layer w0.254: U8.7 48.26,20.6 47.17,21.69 45.01,21.69 43.39,23.32 41.38,23.32 40.77,23.93 40.77,36.02 41.28,36.53 43.71,36.53 CN7.6
HUB7_R1: length 33.1
  Bottom Layer w0.254: CN7.1 39.92,42.84 38.89,41.81 38.89,22.2 39.65,21.44 41.88,21.44 42.42,20.9 42.42,20.24 42.85,19.81 45.34,19.81 45.65,19.5 U8.3
HUB7_R2: length 26.5
  Bottom Layer w0.254: U8.6 47.61,20.14 46.46,21.28 44.37,21.28 42.75,22.91 40.77,22.91 40.26,23.42 40.26,36.78 41.24,37.76 CN7.5
HUB8_B1: length 29.6
  Bottom Layer w0.254: U9.5 59.65,20.08 58.6,21.13 56.48,21.13 55.26,22.35 53.11,22.35 52.45,23.01 52.45,39.37 53.38,40.3 CN8.3
HUB8_B2: length 21.3
  Bottom Layer w0.254: U9.8 61.61,20.41 59.61,22.4 59.61,33.63 59.31,33.93 56.39,33.93 CN8.7
HUB8_G1: length 34.5
  Bottom Layer w0.254: U9.4 59,19.49 57.77,20.73 56.01,20.73 54.84,21.9 52.65,21.9 51.99,22.56 51.99,41.2 52.35,41.55 56.46,41.55 57.65,42.74 CN8.2
HUB8_G2: length 28
  Bottom Layer w0.254: CN8.6 56.41,36.53 53.98,36.53 53.47,36.02 53.47,23.93 54.08,23.32 55.65,23.32 56.77,22.2 59.06,22.2 60.95,20.3 U9.7
HUB8_R1: length 32.6
  Bottom Layer w0.254: CN8.1 52.62,42.84 51.59,41.81 51.59,22.2 52.35,21.44 54.38,21.44 55.55,20.27 57.58,20.27 58.35,19.5 U9.3
HUB8_R2: length 26.4
  Bottom Layer w0.254: U9.6 60.31,20.09 58.7,21.69 56.57,21.69 55.35,22.91 53.47,22.91 52.96,23.42 52.96,36.78 53.94,37.76 CN8.5
LAT: length 128.3
  Top Layer w0.254: v1(14.81,20.83) 14.2,21.44 14.2,25.65 14.86,26.31 18.26,26.31 CN5.14 20.83,26.31 32.03,26.31 ; 44.95,26.57 45.2,26.31 ; 44.95,26.57 44.95,26.32 ; 44.95,26.57 CN7.14 ; 44.95,26.57 44.7,26.31 ; 45.2,26.31 44.7,26.31 ; 45.2,26.31 56.92,26.31 57.65,27.04 CN8.14 ; 32.47,26.31 32.24,26.31 ; 32.47,26.31 32.25,26.54 ; 32.47,26.31 44.7,26.31 ; 32.24,26.31 32.03,26.31 ; 32.24,26.31 32.25,26.32 32.25,26.54 ; 32.25,26.54 32.03,26.31 ; 32.25,26.54 CN6.14
  Bottom Layer w0.254: 44.95,66.7 44.95,66.92 44.95,66.92 ; 44.95,66.7 45.17,66.92 ; 44.95,66.7 44.95,65.7 ; 44.95,66.7 44.72,66.92 ; 19.55,65.7 20.78,66.93 56.13,66.93 57.36,65.7 CN1.14 62.58,65.7 65.97,69.09 U6.16 ; U4.4 16.54,20.27 15.93,20.88 14.86,20.88 v1(14.81,20.83) ; 32.25,66.7 32.25,66.92 32.25,66.92 ; 32.25,66.7 32.02,66.92 ; 32.25,66.7 CN3.14 ; 32.25,66.7 32.47,66.92
OE_PWM_B: length 24.7
  Top Layer w0.254: v1(67.18,94.36) v1(50.55,94.36)
  Bottom Layer w0.254: v1(50.55,94.36) 50.01,94.89 H1.19 ; v1(67.18,94.36) 67.27,94.28 U6.7
OE_PWM_B_O: length 64.7
  Top Layer w0.254: 44.95,73.32 44.95,73.31 44.95,72.03 ; CN4.8 20.83,72.03 32.25,72.03 ; CN3.8 32.25,73.32 32.25,72.03 ; 44.95,72.03 56.36,72.03 CN1.8 67.15,73.32 67.79,73.97 v1(67.79,74.93) ; 44.95,72.03 32.25,72.03
  Bottom Layer w0.254: v1(67.79,74.93) 67.44,75.29 67.44,79.76 67.92,80.24 U6.13
OE_PWM_G: length 21
  Top Layer w0.254: v1(55.12,96.77) 55.12,96.14 56.13,95.12 66.55,95.12 67.06,95.63 67.82,95.63 v1(68.2,95.25)
  Bottom Layer w0.254: v1(68.2,95.25) 68.33,95.12 68.33,93.98 67.92,93.57 U6.8 ; H1.15 55.12,99.7 v1(55.12,96.77)
OE_PWM_G_O: length 61.1
  Top Layer w0.254: 32.24,77.11 32.47,77.11 ; 32.24,77.11 32.25,77.12 32.25,77.33 ; 32.24,77.11 32.03,77.11 ; 32.47,77.11 44.73,77.11 ; 32.47,77.11 32.25,77.33 ; 44.95,77.33 45.17,77.11 ; 44.95,77.33 44.73,77.11 ; 44.95,77.33 44.95,77.12 44.95,77.11 ; 44.95,77.33 44.95,78.4 ; 45.17,77.11 44.95,77.11 ; 45.17,77.11 56.36,77.11 CN1.4 67.71,78.4 v1(68.45,79.15) ; 32.25,77.33 32.03,77.11 ; 32.25,77.33 CN3.4 ; 44.95,77.11 44.73,77.11 ; CN4.4 20.83,77.11 32.03,77.11
  Bottom Layer w0.254: v1(68.45,79.15) 68.57,79.26 U6.12
OE_PWM_R: length 8.6
  Bottom Layer w0.254: H1.5 67.79,96.8 69.09,95.5 69.09,93.73 68.57,93.21 U6.9
OE_PWM_R_O: length 80.3
  Bottom Layer w0.254: U6.11 69.22,65.54 65.25,61.57 56.7,61.57 CN1.15 53.67,61.72 42.68,61.72 42.64,61.76 ; 42.64,61.76 42.42,61.99 ; 42.64,61.76 42.64,61.72 42.15,61.72 ; 42.42,61.99 42.42,63.15 CN2.15 ; 42.42,61.99 42.15,61.72 ; 42.15,61.72 29.92,61.72 ; 29.49,61.72 18.45,61.72 CN4.15 ; 29.49,61.72 29.71,61.94 ; 29.49,61.72 29.92,61.72 ; 29.71,61.94 29.71,61.72 ; 29.71,61.94 29.92,61.72 ; 29.71,61.94 CN3.15
RD0: length 11.8
  Bottom Layer w0.254: U5.7 56.73,94.45 58.93,96.65 58.93,100.97 H1.14
RD1: length 11.3
  Bottom Layer w0.254: H1.18 53.85,100.97 53.85,96.65 54.78,95.72 U5.4
RD2: length 12.3
  Bottom Layer w0.254: U3.9 45.33,95.24 48.77,98.68 48.77,100.97 H1.22
RD3: length 11.3
  Bottom Layer w0.254: H1.26 43.69,100.97 43.69,96.9 42.73,95.94 42.73,91.9
RD4: length 15.4
  Bottom Layer w0.254: H1.30 38.61,100.97 38.61,97.54 37.21,96.14 33.78,96.14 32.63,94.98 U2.9
RD5: length 12.4
  Bottom Layer w0.254: H1.34 33.53,100.97 33.53,99.06 30.03,95.56 U2.5
RD6: length 16.4
  Bottom Layer w0.254: U1.9 19.93,93.33 20.57,93.98 24.13,93.98 28.32,98.17 28.32,101.1 H1.38
RD7: length 15.6
  Bottom Layer w0.254: H1.42 23.24,101.1 23.24,97.54 21.84,96.14 17.91,96.14 17.33,95.56 U1.5
RD8: length 15
  Bottom Layer w0.254: H2.14 25.88,5 25.88,7.06 25.32,7.62 19.13,7.62 17.84,8.91 U4.19
RD9: length 18.5
  Bottom Layer w0.254: H2.18 30.96,5 30.96,8.38 30.56,8.79 20.55,8.79 19.79,9.55 U4.16
RD10: length 8.8
  Bottom Layer w0.254: H2.22 36.04,5 36.04,7.16 34.47,8.74 U7.21
RD11: length 11.4
  Bottom Layer w0.254: H2.26 41.12,5 41.12,6.81 39.9,8.03 37.72,8.03 36.42,9.33 U7.18
RD12: length 8.1
  Bottom Layer w0.254: H2.30 46.2,5 46.2,7.37 46.3,7.47 U8.21
RD13: length 10.1
  Bottom Layer w0.254: U8.18 48.26,8.46 49.25,7.47 50.57,7.47 51.28,6.76 51.28,5 H2.34
RD14: length 10.1
  Bottom Layer w0.254: H2.38 56.41,4.95 56.41,7.57 57.07,8.23 58.55,8.23 59,8.69 U9.21
RD15: length 8.3
  Bottom Layer w0.254: U9.18 60.95,7.65 61.44,7.16 61.44,5 H2.42
STB: length 7.9
  Bottom Layer w0.254: H1.7 65.25,97.31 65.32,97.24 U6.4
STB_IN: length 5.9
  Bottom Layer w0.254: H2.7 19.53,6.5 17.19,8.85 U4.20
$1N9953: length 2.4
  Top Layer w0.381: LED1.1 6.08,8.05 R1.1

## Copper pours and planes (outline as drawn; the poured copper is in the pictures)
GND on Top Layer: -0.99,110.19 81.05,110.19 86.49,104.75 86.49,-0.91 82.83,-4.57 -10.9,-4.57 -14.81,-0.66 -14.81,96.37
GND on Bottom Layer: -0.63,112.17 84.51,112.17 90.5,106.17 90.5,-12.55 87.25,-15.8 -1.96,-15.8 -27.46,9.7 -11,26.16 -11,112.37 -0.84,112.37

## Text on the board
Top Silkscreen Layer: 1 | 2 | 3 | 4 | <- | 输出 | 输入
